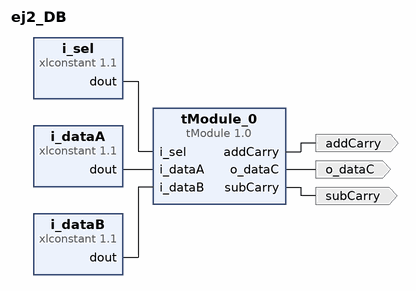
[diagram p0: block diagram of the top level]
# Vivado block design ej2_DB, xc7a12ticsg325-1L, Vivado 2024.2
create_bd_design ej2_DB

create_bd_port -dir O o_dataC
create_bd_port -dir O addCarry
create_bd_port -dir O subCarry

create_bd_cell -type ip -vlnv xilinx.com:user:tModule:1.0 tModule_0
create_bd_cell -type ip -vlnv xilinx.com:ip:xlconstant:1.1 i_dataB
set_property -dict {CONFIG.CONST_WIDTH 16} [get_bd_cells i_dataB]
create_bd_cell -type ip -vlnv xilinx.com:ip:xlconstant:1.1 i_dataA
set_property -dict {CONFIG.CONST_WIDTH 16} [get_bd_cells i_dataA]
create_bd_cell -type ip -vlnv xilinx.com:ip:xlconstant:1.1 i_sel
set_property -dict {CONFIG.CONST_WIDTH 2} [get_bd_cells i_sel]

# ---- connections ----

connect_bd_net [get_bd_pins tModule_0/addCarry] [get_bd_ports addCarry]
connect_bd_net [get_bd_pins tModule_0/o_dataC] [get_bd_ports o_dataC]
connect_bd_net [get_bd_pins tModule_0/subCarry] [get_bd_ports subCarry]
connect_bd_net -net xlconstant_0_dout [get_bd_pins i_sel/dout] [get_bd_pins tModule_0/i_sel]
connect_bd_net -net xlconstant_1_dout [get_bd_pins i_dataA/dout] [get_bd_pins tModule_0/i_dataA]
connect_bd_net -net xlconstant_2_dout [get_bd_pins i_dataB/dout] [get_bd_pins tModule_0/i_dataB]

validate_bd_design
save_bd_design
